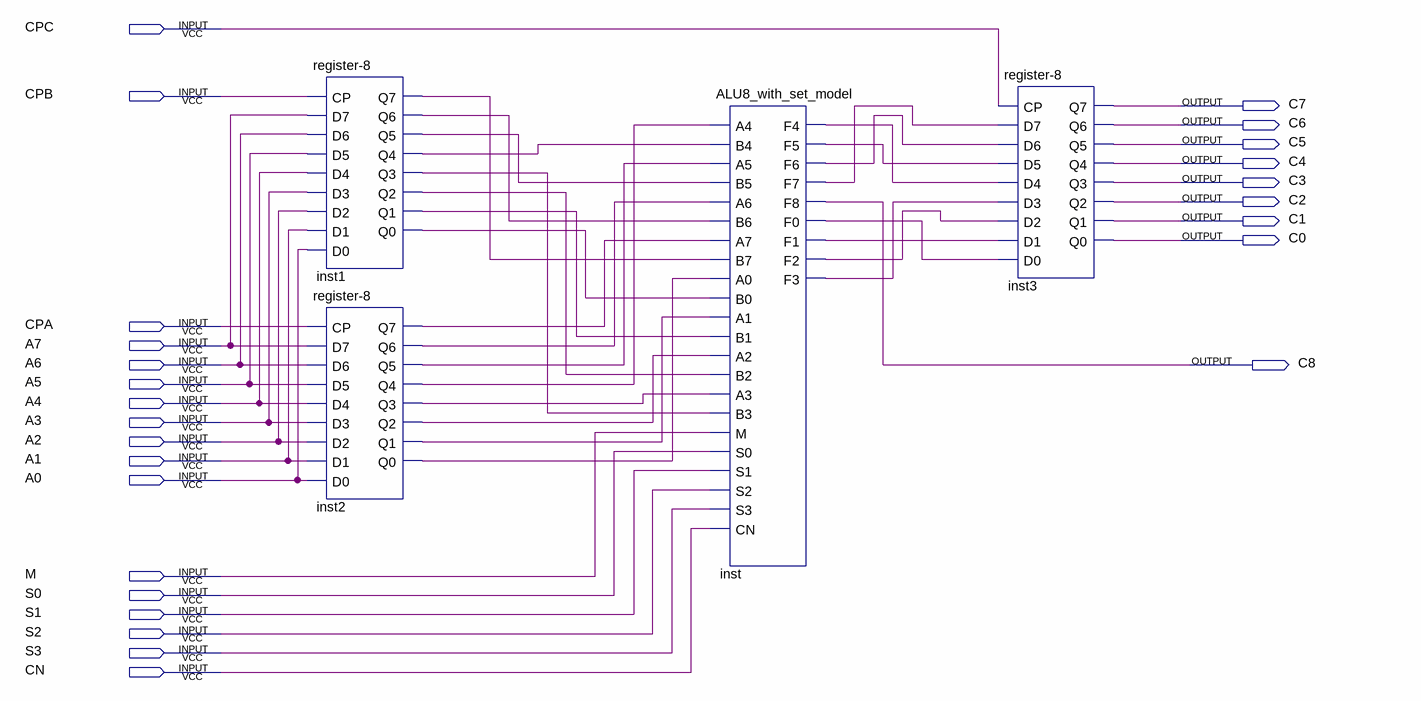
[diagram p0: schematic sheet]
// Quartus schematic ALU8_with_register.bdf as structural Verilog: 4 symbols, 26 pins
module ALU8_with_register (
  input  CPC,
  input  CPB,
  input  CPA,
  input  A7,
  input  A6,
  input  A5,
  input  A4,
  input  A3,
  input  A2,
  input  A1,
  input  A0,
  input  M,
  input  S0,
  input  S1,
  input  S2,
  input  S3,
  input  CN,
  output C7,
  output C6,
  output C5,
  output C4,
  output C3,
  output C2,
  output C1,
  output C0,
  output C8
);

  wire inst1_q0, inst1_q1, inst1_q2, inst1_q3, inst1_q4, inst1_q5, inst1_q6, inst1_q7, inst2_q0, inst2_q1,
       inst2_q2, inst2_q3, inst2_q4, inst2_q5, inst2_q6, inst2_q7, inst_f0, inst_f1, inst_f2, inst_f3,
       inst_f4, inst_f5, inst_f6, inst_f7;

  \register-8  inst1 (
    .CP(CPB), .D7(A7), .D6(A6), .D5(A5), .D4(A4), .D3(A3), .D2(A2), .D1(A1), .D0(A0), .Q7(inst1_q7),
    .Q6(inst1_q6), .Q5(inst1_q5), .Q4(inst1_q4), .Q3(inst1_q3), .Q2(inst1_q2), .Q1(inst1_q1), .Q0(inst1_q0));
  \register-8  inst2 (
    .CP(CPA), .D7(A7), .D6(A6), .D5(A5), .D4(A4), .D3(A3), .D2(A2), .D1(A1), .D0(A0), .Q7(inst2_q7),
    .Q6(inst2_q6), .Q5(inst2_q5), .Q4(inst2_q4), .Q3(inst2_q3), .Q2(inst2_q2), .Q1(inst2_q1), .Q0(inst2_q0));
  ALU8_with_set_model inst (
    .A4(inst2_q4), .B4(inst1_q4), .A5(inst2_q5), .B5(inst1_q5), .A6(inst2_q6), .B6(inst1_q6), .A7(inst2_q7),
    .B7(inst1_q7), .A0(inst2_q0), .B0(inst1_q0), .A1(inst2_q1), .B1(inst1_q1), .A2(inst2_q2), .B2(inst1_q2),
    .A3(inst2_q3), .B3(inst1_q3), .M(M), .S0(S0), .S1(S1), .S2(S2), .S3(S3), .CN(CN), .F4(inst_f4),
    .F5(inst_f5), .F6(inst_f6), .F7(inst_f7), .F8(C8), .F0(inst_f0), .F1(inst_f1), .F2(inst_f2), .F3(inst_f3));
  \register-8  inst3 (
    .CP(CPC), .D7(inst_f7), .D6(inst_f6), .D5(inst_f5), .D4(inst_f4), .D3(inst_f3), .D2(inst_f2),
    .D1(inst_f1), .D0(inst_f0), .Q7(C7), .Q6(C6), .Q5(C5), .Q4(C4), .Q3(C3), .Q2(C2), .Q1(C1), .Q0(C0));
endmodule
